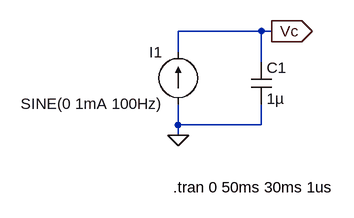
[diagram p0: schematic Lesson24_RC.asc]
Lesson24_RC.asc, the LTspice schematic file:
Version 4
SHEET 1 880 680
WIRE 320 224 192 224
WIRE 336 224 320 224
WIRE 192 256 192 224
WIRE 320 272 320 224
WIRE 192 368 192 336
WIRE 320 368 320 336
WIRE 320 368 192 368
WIRE 192 384 192 368
FLAG 192 384 0
FLAG 336 224 Vc
IOPIN 336 224 Out
SYMBOL cap 304 272 R0
SYMATTR InstName C1
SYMATTR Value 1µ
SYMBOL current 192 336 R180
WINDOW 0 24 80 Left 2
WINDOW 3 24 0 Left 2
SYMATTR InstName I1
SYMATTR Value SINE(0 1mA 100Hz)
TEXT 184 464 Left 2 !.tran 0 50ms 30ms 1us

The netlist it stands for:
* Lesson24_RC.asc
C1 Vc 0 1µ
I1 0 Vc SINE(0 1mA 100Hz)
.tran 0 50ms 30ms 1us
.backanno
.end